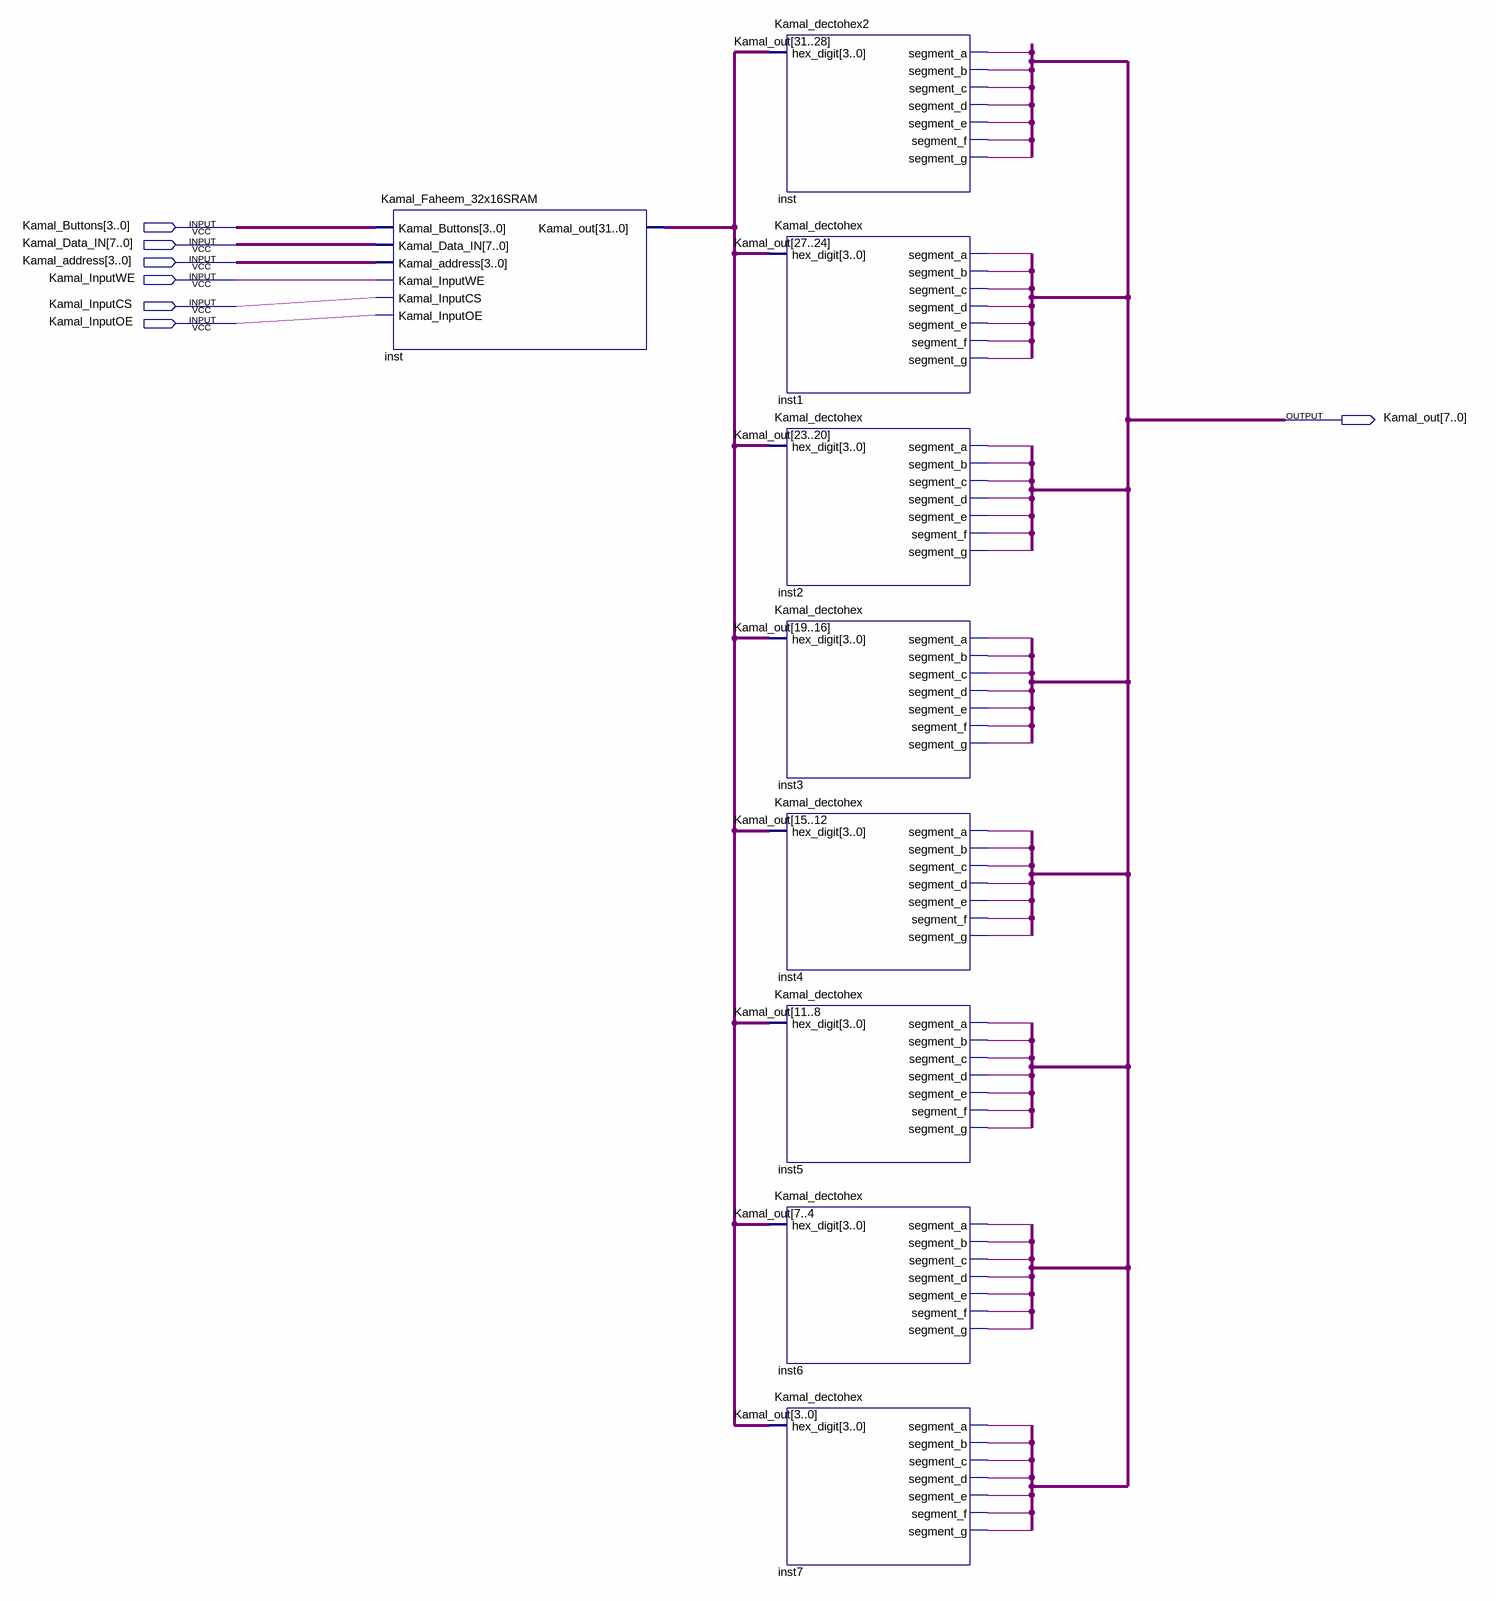
[diagram p0: schematic sheet]
// Quartus schematic Kamal_Faheem_32x16SRAMwithDectoHex.bdf as structural Verilog: 9 symbols, 7 pins
module Kamal_Faheem_32x16SRAMwithDectoHex (
  input  [3:0] Kamal_Buttons,
  input  [7:0] Kamal_Data_IN,
  input  [3:0] Kamal_address,
  input  Kamal_InputWE,
  input  Kamal_InputCS,
  input  Kamal_InputOE,
  output [31:0] Kamal_out
);

  wire inst1_segment_a, inst1_segment_b, inst1_segment_c, inst1_segment_d, inst1_segment_e, inst1_segment_f,
       inst1_segment_g, inst2_segment_a, inst2_segment_b, inst2_segment_c, inst2_segment_d, inst2_segment_e,
       inst2_segment_f, inst2_segment_g, inst3_segment_a, inst3_segment_b, inst3_segment_c, inst3_segment_d,
       inst3_segment_e, inst3_segment_f, inst3_segment_g, inst4_segment_a, inst4_segment_b, inst4_segment_c,
       inst4_segment_d, inst4_segment_e, inst4_segment_f, inst4_segment_g, inst5_segment_a, inst5_segment_b,
       inst5_segment_c, inst5_segment_d, inst5_segment_e, inst5_segment_f, inst5_segment_g, inst6_segment_a,
       inst6_segment_b, inst6_segment_c, inst6_segment_d, inst6_segment_e, inst6_segment_f, inst6_segment_g,
       inst7_segment_a, inst7_segment_b, inst7_segment_c, inst7_segment_d, inst7_segment_e, inst7_segment_f,
       inst7_segment_g, inst_segment_a, inst_segment_b, inst_segment_c, inst_segment_d, inst_segment_e,
       inst_segment_f, inst_segment_g, \Kamal_out[7..4 , \Kamal_out[11..8 , \Kamal_out[15..12 ;

  Kamal_Faheem_32x16SRAM inst (
    .Kamal_Buttons(Kamal_Buttons), .Kamal_Data_IN(Kamal_Data_IN), .Kamal_address(Kamal_address),
    .Kamal_InputWE(Kamal_InputWE), .Kamal_InputCS(Kamal_InputCS), .Kamal_InputOE(Kamal_InputOE),
    .Kamal_out(Kamal_out[31:28]));
  Kamal_dectohex2 inst_dup2 (
    .hex_digit(Kamal_out[31:28]), .segment_a(inst_segment_a), .segment_b(inst_segment_b),
    .segment_c(inst_segment_c), .segment_d(inst_segment_d), .segment_e(inst_segment_e),
    .segment_f(inst_segment_f), .segment_g(inst_segment_g));
  Kamal_dectohex inst1 (
    .hex_digit(Kamal_out[27:24]), .segment_a(inst1_segment_a), .segment_b(inst1_segment_b),
    .segment_c(inst1_segment_c), .segment_d(inst1_segment_d), .segment_e(inst1_segment_e),
    .segment_f(inst1_segment_f), .segment_g(inst1_segment_g));
  Kamal_dectohex inst2 (
    .hex_digit(Kamal_out[23:20]), .segment_a(inst2_segment_a), .segment_b(inst2_segment_b),
    .segment_c(inst2_segment_c), .segment_d(inst2_segment_d), .segment_e(inst2_segment_e),
    .segment_f(inst2_segment_f), .segment_g(inst2_segment_g));
  Kamal_dectohex inst3 (
    .hex_digit(Kamal_out[19:16]), .segment_a(inst3_segment_a), .segment_b(inst3_segment_b),
    .segment_c(inst3_segment_c), .segment_d(inst3_segment_d), .segment_e(inst3_segment_e),
    .segment_f(inst3_segment_f), .segment_g(inst3_segment_g));
  Kamal_dectohex inst4 (
    .hex_digit({4{\Kamal_out[15..12 }}), .segment_a(inst4_segment_a), .segment_b(inst4_segment_b),
    .segment_c(inst4_segment_c), .segment_d(inst4_segment_d), .segment_e(inst4_segment_e),
    .segment_f(inst4_segment_f), .segment_g(inst4_segment_g));
  Kamal_dectohex inst5 (
    .hex_digit({4{\Kamal_out[11..8 }}), .segment_a(inst5_segment_a), .segment_b(inst5_segment_b),
    .segment_c(inst5_segment_c), .segment_d(inst5_segment_d), .segment_e(inst5_segment_e),
    .segment_f(inst5_segment_f), .segment_g(inst5_segment_g));
  Kamal_dectohex inst6 (
    .hex_digit({4{\Kamal_out[7..4 }}), .segment_a(inst6_segment_a), .segment_b(inst6_segment_b),
    .segment_c(inst6_segment_c), .segment_d(inst6_segment_d), .segment_e(inst6_segment_e),
    .segment_f(inst6_segment_f), .segment_g(inst6_segment_g));
  Kamal_dectohex inst7 (
    .hex_digit(Kamal_out[3:0]), .segment_a(inst7_segment_a), .segment_b(inst7_segment_b),
    .segment_c(inst7_segment_c), .segment_d(inst7_segment_d), .segment_e(inst7_segment_e),
    .segment_f(inst7_segment_f), .segment_g(inst7_segment_g));
endmodule
